# Altium schematic sheet Connectors.SchDoc: Connectors
size OrCAD A; Date: Not used; ApprovedBy: Not used; CheckedBy: Not used; Author: Not used; CompanyName: STMicroelectronics; DrawnBy: Not used; Engineer: Not used; Organization: Not used; Address1: Not used; Address2: Not used; Address3: Not used; Address4: Not used; DocumentNumber: 5; Revision: Not used; SheetNumber: 5; SheetTotal: 9; CurrentTime: Not used; CurrentDate: Not used; Time: Not used; DocumentFullPathAndName: Not used; DocumentName: Not used; ModifiedDate: Not used; ImagePath: Not used; ProjectName: Not used; Application_BuildNumber: Not used
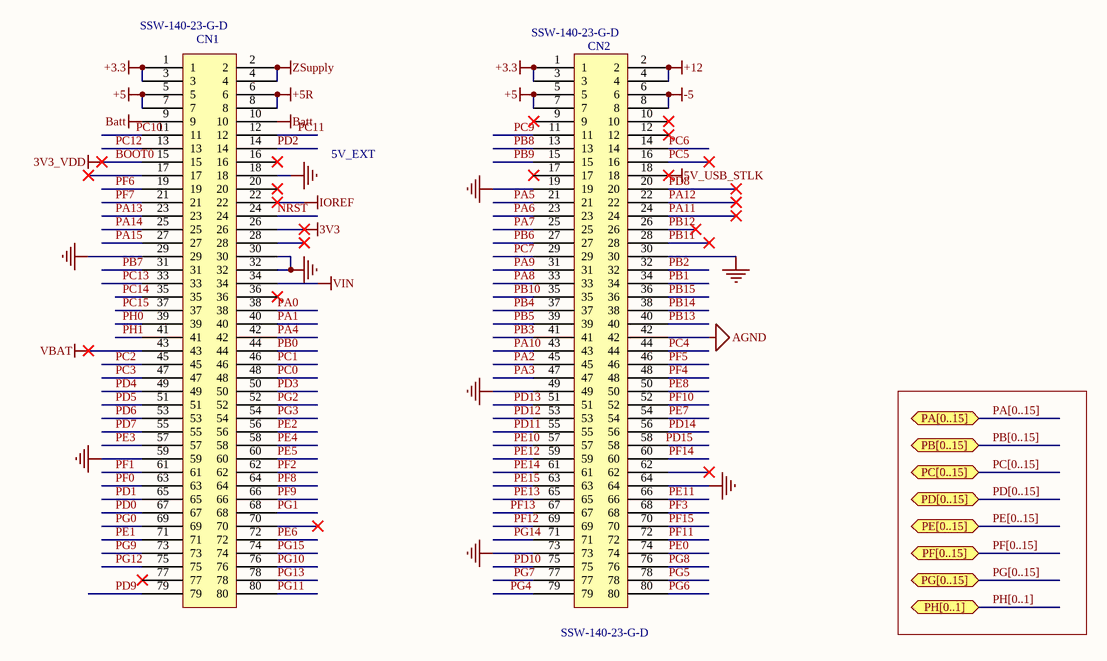
[diagram p0: Connectors.SchDoc]

## Parts
CN1  SSW-140-23-G-D  [SSW-140-23-G-D]
CN2  SSW-140-23-G-D  [SSW-140-23-G-D]

## Ports
PA[0..15] (bidir), PB[0..15] (bidir), PC[0..15] (bidir), PD[0..15] (bidir), PE[0..15] (bidir), PF[0..15] (bidir), PG[0..15] (bidir), PH[0..1] (bidir)

## Nets
3V3: CN1.26
5V_USB_STLK: CN2.18
+3.3: CN1.1 CN1.3 CN2.1 CN2.3
+5: CN1.5 CN1.7 CN2.5 CN2.7
+5R: CN1.6 CN1.8
+12: CN2.2 CN2.4
-5: CN2.6 CN2.8
AGND: CN2.42
Batt: CN1.9 CN1.10
BOOT0: CN1.15  [also labelled 3V3_VDD]
GND: CN1.18 CN1.29 CN1.30 CN1.32 CN1.59 CN2.19 CN2.30 CN2.49 CN2.64 CN2.73
IOREF: CN1.22
VBAT: CN1.43
VIN: CN1.34
ZSupply: CN1.2 CN1.4
NRST: CN1.24
PA0: CN1.38
PA1: CN1.40
PA2: CN2.45
PA3: CN2.47
PA4: CN1.42
PA5: CN2.21
PA6: CN2.23
PA7: CN2.25
PA8: CN2.33
PA9: CN2.31
PA10: CN2.43
PA11: CN2.24
PA12: CN2.22
PA13: CN1.23
PA14: CN1.25
PA15: CN1.27
PB0: CN1.44
PB1: CN2.34
PB2: CN2.32
PB3: CN2.41
PB4: CN2.37
PB5: CN2.39
PB6: CN2.27
PB7: CN1.31
PB8: CN2.13
PB9: CN2.15
PB10: CN2.35
PB11: CN2.28
PB12: CN2.26
PB13: CN2.40
PB14: CN2.38
PB15: CN2.36
PC0: CN1.48
PC1: CN1.46
PC2: CN1.45
PC3: CN1.47
PC4: CN2.44
PC5: CN2.16
PC6: CN2.14
PC7: CN2.29
PC9: CN2.11
PC10: CN1.11
PC11: CN1.12
PC12: CN1.13
PC13: CN1.33
PC14: CN1.35
PC15: CN1.37
PD0: CN1.67
PD1: CN1.65
PD2: CN1.14
PD3: CN1.50
PD4: CN1.49
PD5: CN1.51
PD6: CN1.53
PD7: CN1.55
PD8: CN2.20
PD9: CN1.79
PD10: CN2.75
PD11: CN2.55
PD12: CN2.53
PD13: CN2.51
PD14: CN2.56
PE0: CN2.74
PE1: CN1.71
PE2: CN1.56
PE3: CN1.57
PE4: CN1.58
PE5: CN1.60
PE6: CN1.72
PE7: CN2.54
PE8: CN2.50
PE10: CN2.57
PE11: CN2.66
PE12: CN2.59
PE13: CN2.65
PE14: CN2.61
PE15: CN2.63
PF0: CN1.63
PF1: CN1.61
PF2: CN1.62
PF3: CN2.68
PF4: CN2.48
PF5: CN2.46
PF6: CN1.19
PF7: CN1.21
PF8: CN1.64
PF9: CN1.66
PF10: CN2.52
PF11: CN2.72
PF12: CN2.69
PF13: CN2.67
PF14: CN2.60
PF15: CN2.70
PG0: CN1.69
PG1: CN1.68
PG2: CN1.52
PG3: CN1.54
PG4: CN2.79
PG5: CN2.78
PG6: CN2.80
PG7: CN2.77
PG8: CN2.76
PG9: CN1.73
PG10: CN1.76
PG11: CN1.80
PG12: CN1.75
PG13: CN1.78
PG14: CN2.71
PG15: CN1.74
PH0: CN1.39
PH1: CN1.41

Not connected (* = marked no-connect by the designer): CN1 16* 17* 20* 28* 36* 70* 77*; CN2 9* 10* 12* 17* 58 62*

## Buses and harness runs
bus PA[0..15] = port PA[0..15]
bus PB[0..15] = port PB[0..15]
bus PC[0..15] = port PC[0..15]
bus PD[0..15] = port PD[0..15]
bus PE[0..15] = port PE[0..15]
bus PF[0..15] = port PF[0..15]
bus PG[0..15] = port PG[0..15]
bus PH[0..1] = port PH[0..1]

## Notes on the sheet
- 5V_EXT
- Labels drawn without touching a wire or pin: PD15
- Title
- Size:
- Date:
- Orcad A
- Number:
- Time:
- Revision:
- Sheet
- of
- File:

## Library data of the parts
CN1 CN2 = SSW-140-23-G-D: 80 Position Receptacle Connector Through Hole; Manufacturer: Samtec; Number of Contacts: 80; Gender: Female; Pitch: 2.54mm; Supplier 1: Avnet; Supplier Part Number 1: SSW-140-23-G-D; Manufacturer Part Number: SSW-140-23-G-D; Stock 1: 0; Pricing 1: 1=13.99000, 10=13.29000, 25=12.59000, 50=12.09000, 100=11.29000 (USD); RoHS: Yes; Mount: Through Hole; Contact Plating: Gold; Number of Rows: 2; Packaging: Bulk; Termination: Solder; Radiation Hardening: No; ComponentLink1URL: http://www.samtec.com/documents/webfiles/pdf/SSQ_TH.PDF?src-supplier=Avnet; ComponentLink1Description: http://www.samtec.com/documents/webfiles/pdf/SSQ_TH.PDF?src-supplier=Avnet